# Altium schematic sheet S7CAS-PLEIADES-CARTE-MERE_Pxx_IO_SENSOR.SchDoc
size Tabloid; SheetNumber: 14; SheetTotal: 18; Sheet_Name: BTN, LED, TEMP SENSOR; Size: 11x17
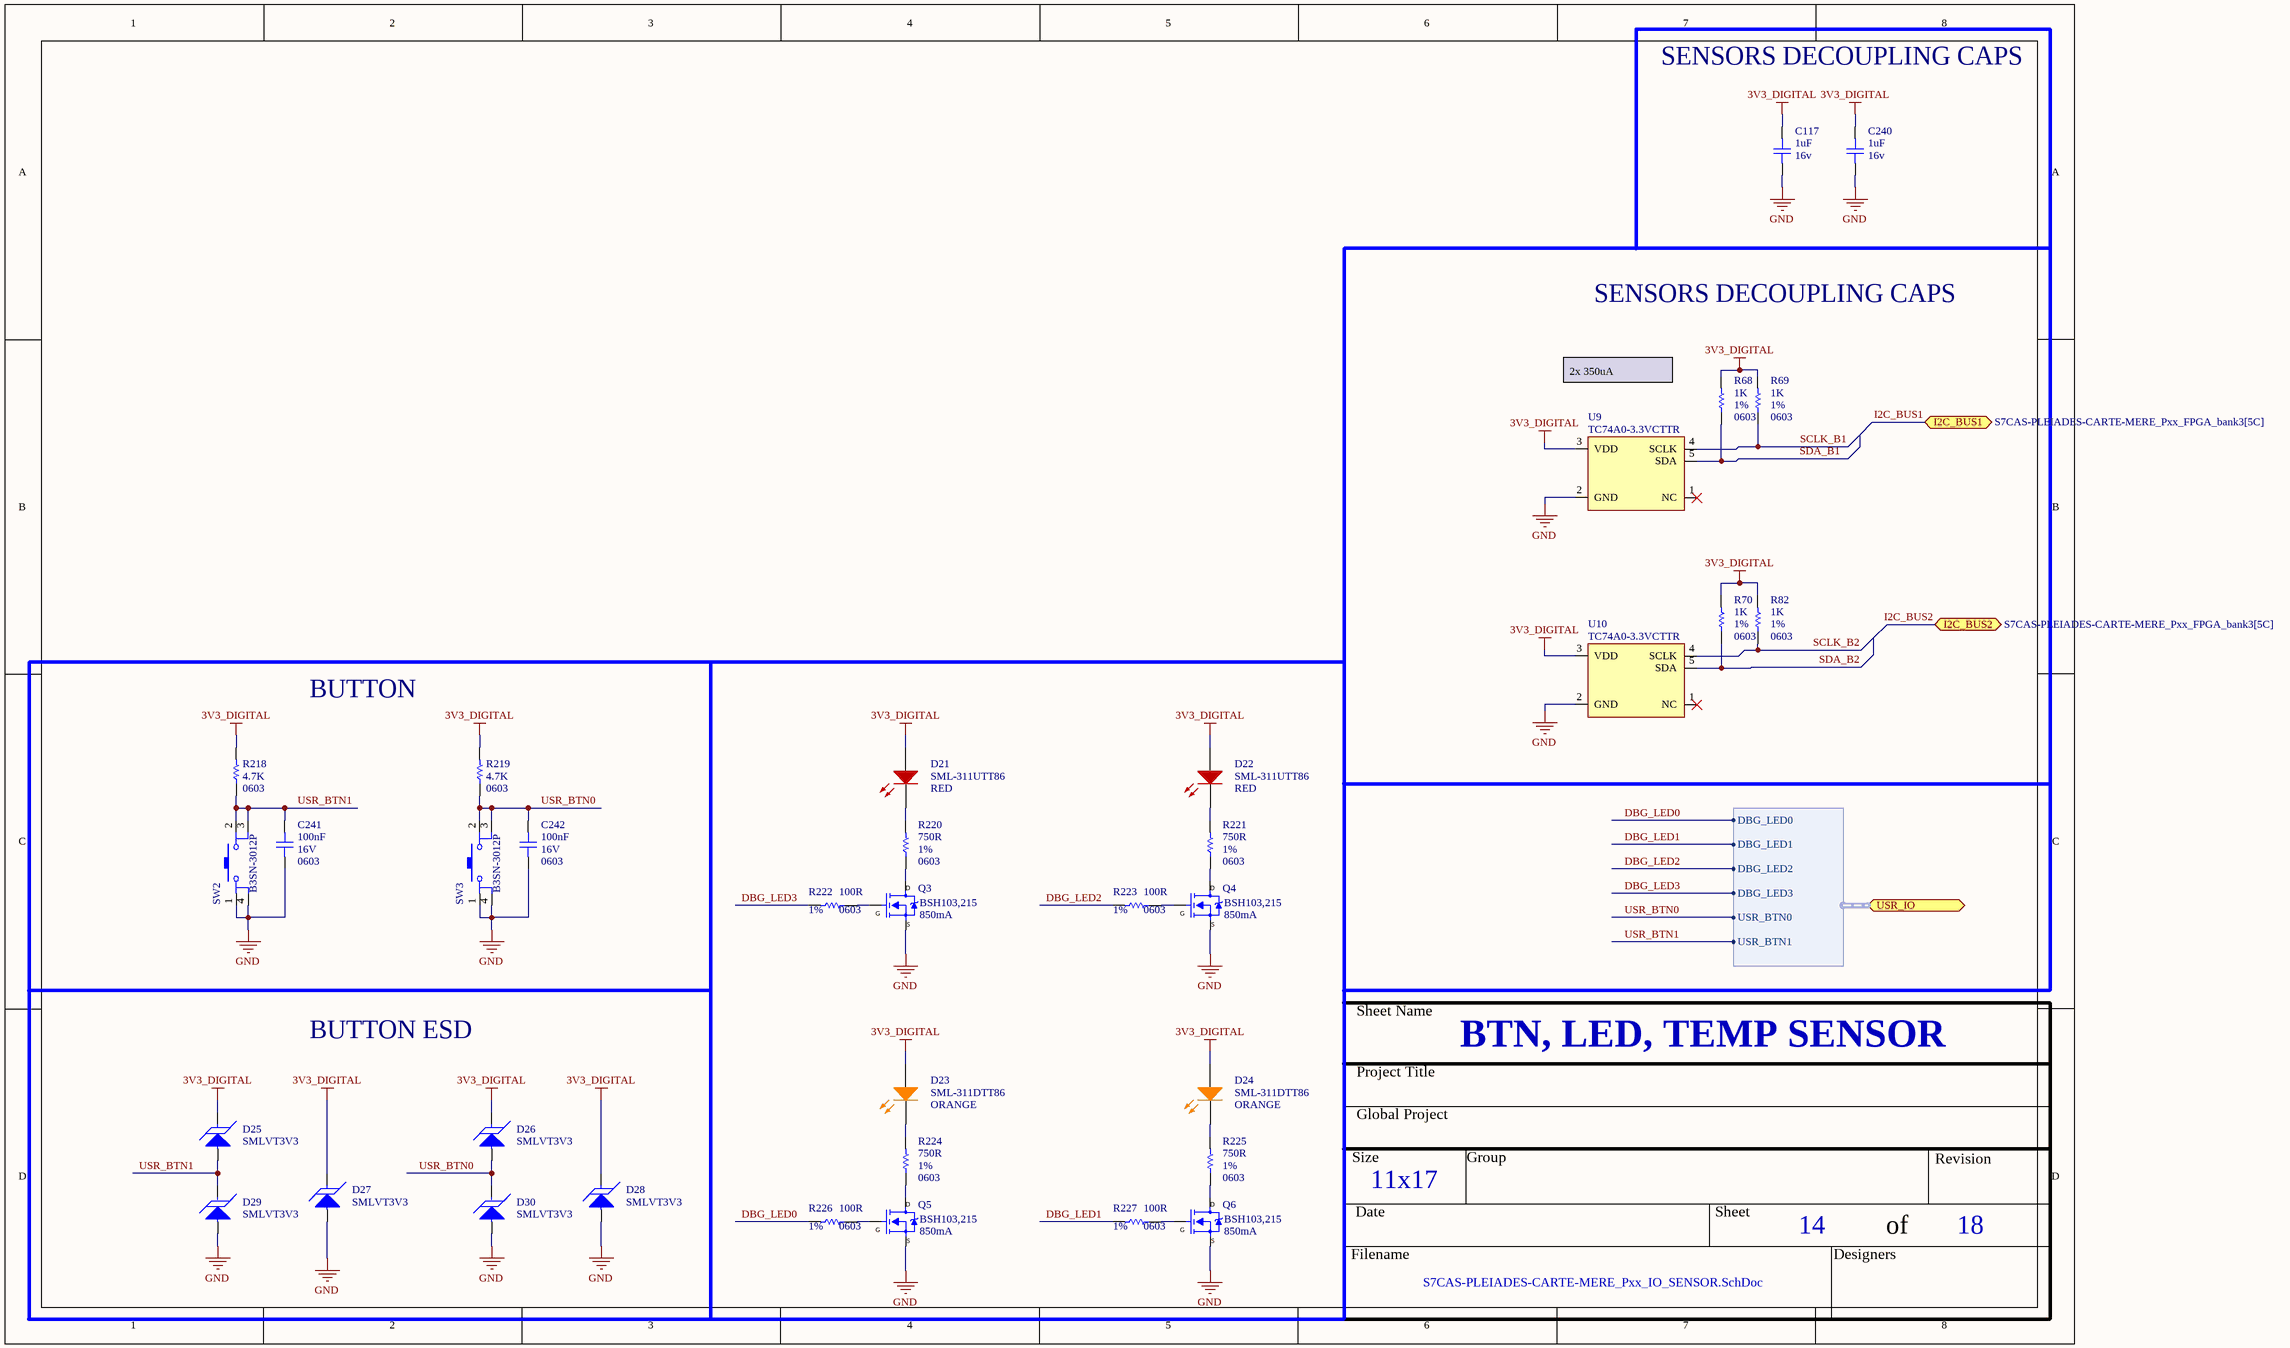
[diagram p0: S7CAS-PLEIADES-CARTE-MERE_Pxx_IO_SENSOR.SchDoc]

## Parts
C117  value 1uF  Voltage: 16v  [CAP_0603]  (hidden comment: CAP - 0603)
C240  value 1uF  Voltage: 16v  [CAP_0603]  (hidden comment: CAP - 0603)
C241  value 100nF  Voltage: 16V  Package: 0603  [CAP_0603]  (hidden comment: CAP - 0603)
C242  value 100nF  Voltage: 16V  Package: 0603  [CAP_0603]  (hidden comment: CAP - 0603)
D21  SML-311UTT86  value RED  [LED_0603]
D22  SML-311UTT86  value RED  [LED_0603]
D23  SML-311DTT86  value ORANGE  [LED_0603]
D24  SML-311DTT86  value ORANGE  [LED_0603]
D25  SMLVT3V3  [TVS_POW_SMLVT3V3]
D26  SMLVT3V3  [TVS_POW_SMLVT3V3]
D27  SMLVT3V3  [TVS_POW_SMLVT3V3]
D28  SMLVT3V3  [TVS_POW_SMLVT3V3]
D29  SMLVT3V3  [TVS_POW_SMLVT3V3]
D30  SMLVT3V3  [TVS_POW_SMLVT3V3]
Q3  BSH103,215  Current: 850mA  [SOT23-3]
Q4  BSH103,215  Current: 850mA  [SOT23-3]
Q5  BSH103,215  Current: 850mA  [SOT23-3]
Q6  BSH103,215  Current: 850mA  [SOT23-3]
R68  value 1K  Package: 0603  Precision: 1%  [RES_0603]  (hidden comment: RES - 0603)
R69  value 1K  Package: 0603  Precision: 1%  [RES_0603]  (hidden comment: RES - 0603)
R70  value 1K  Package: 0603  Precision: 1%  [RES_0603]  (hidden comment: RES - 0603)
R82  value 1K  Package: 0603  Precision: 1%  [RES_0603]  (hidden comment: RES - 0603)
R218  value 4.7K  Package: 0603  [RES_0603]  (hidden comment: RES - 0603)
R219  value 4.7K  Package: 0603  [RES_0603]  (hidden comment: RES - 0603)
R220  value 750R  Package: 0603  Precision: 1%  [RES_0603]  (hidden comment: RES - 0603)
R221  value 750R  Package: 0603  Precision: 1%  [RES_0603]  (hidden comment: RES - 0603)
R222  value 100R  Package: 0603  Precision: 1%  [RES_0603]  (hidden comment: RES - 0603)
R223  value 100R  Package: 0603  Precision: 1%  [RES_0603]  (hidden comment: RES - 0603)
R224  value 750R  Package: 0603  Precision: 1%  [RES_0603]  (hidden comment: RES - 0603)
R225  value 750R  Package: 0603  Precision: 1%  [RES_0603]  (hidden comment: RES - 0603)
R226  value 100R  Package: 0603  Precision: 1%  [RES_0603]  (hidden comment: RES - 0603)
R227  value 100R  Package: 0603  Precision: 1%  [RES_0603]  (hidden comment: RES - 0603)
SW2  B3SN-3012P  [SWI_TACT_B3SN-3012P]
SW3  B3SN-3012P  [SWI_TACT_B3SN-3012P]
U9  TC74A0-3.3VCTTR  [SEN_TEMP_TC74A0-3.3VCTTR]
U10  TC74A0-3.3VCTTR  [SEN_TEMP_TC74A0-3.3VCTTR]

## Blocks framed on the sheet
SENSORS DECOUPLING CAPS: C117 C240
SENSORS DECOUPLING CAPS: R68-R70 R82 U9 U10
BUTTON: C241 C242 R218 R219 SW2 SW3
BUTTON ESD: D25-D30

## Ports
I2C_BUS1 (bidir, see S7CAS-PLEIADES-CARTE-MERE_Pxx_FPGA_bank3[5C]), I2C_BUS2 (bidir, see S7CAS-PLEIADES-CARTE-MERE_Pxx_FPGA_bank3[5C]), USR_IO (bidir, harness USER_IOS_HARNESS, see S7CAS-PLEIADES-CARTE-MERE_Pxx_FPGA_bank3[5C])

## Harnesses
USER_IOS_HARNESS: DBG_LED0, DBG_LED1, DBG_LED2, DBG_LED3, USR_BTN0, USR_BTN1

## Nets
3V3_DIGITAL: C117.2 C240.2 D21.A D22.A D23.A D24.A D25.K D26.K D27.K D28.K R68.2 R69.2 R70.2 R82.2 R218.2 R219.2 U9.3(VDD) U10.3(VDD)
GND: C117.1 C240.1 C241.1 C242.1 D27.A D28.A D29.A D30.A Q3.2 Q4.2 Q5.2 Q6.2 SW2.1 SW2.4 SW3.1 SW3.4 U9.2(GND) U10.2(GND)
DBG_LED0: R226.2 ; port USR_IO.DBG_LED0
DBG_LED1: R227.2 ; port USR_IO.DBG_LED1
DBG_LED2: R223.2 ; port USR_IO.DBG_LED2
DBG_LED3: R222.2 ; port USR_IO.DBG_LED3
SCLK_B1: R69.1 U9.4(SCLK)
SCLK_B2: R82.1 U10.4(SCLK)
SDA_B1: R68.1 U9.5(SDA)
SDA_B2: R70.1 U10.5(SDA)
USR_BTN0: C242.2 D26.A D30.K R219.1 SW3.2 SW3.3 ; port USR_IO.USR_BTN0
USR_BTN1: C241.2 D25.A D29.K R218.1 SW2.2 SW2.3 ; port USR_IO.USR_BTN1
NetD21_K: D21.K R220.2
NetD22_K: D22.K R221.2
NetD23_K: D23.K R224.2
NetD24_K: D24.K R225.2
NetQ3_1: Q3.1 R222.1
NetQ3_3: Q3.3 R220.1
NetQ4_1: Q4.1 R223.1
NetQ4_3: Q4.3 R221.1
NetQ5_1: Q5.1 R226.1
NetQ5_3: Q5.3 R224.1
NetQ6_1: Q6.1 R227.1
NetQ6_3: Q6.3 R225.1

Not connected (* = marked no-connect by the designer): U9 1(NC)*; U10 1(NC)*

## Buses and harness runs
bus I2C_BUS1 = port I2C_BUS1
bus I2C_BUS2 = port I2C_BUS2

## Notes on the sheet
- 2x 350uA
- Sheet Name
- Project Title
- Global Project
- Size
- Group
- Revision
- Date
- Sheet
- of
- Filename
- Designers
- (in symbol MOS_N_CHANNEL) D; G; S

## Library data of the parts
C117 C240-C242 = CAP - 0603: Precision: 10%; Current: *; CreatedBy: Jonathan Bouchard; Power: *; Supplier 1: Arrow Electronics
  C117 C240: Package: 0603; Supplier Part Number 1: CL10B105MO8NNWC
  C241 C242: Supplier Part Number 1: CL10B104KO8NNNC
D21 D22 = LED_SML-311UTT86: LED - 620nM RED 2mA - 0603; Voltage: 1.8V; Mfg: ROHM Semiconductor; Power: 44mW; Current: 2mA; HelpURL: http://media.digikey.com/pdf/Data%20Sheets/Rohm%20PDFs/SML-311%20Series.pdf; CreatedBy: Jonathan Bouchard; Temperature: -30°C to 85°C; Package: 0603; Precision: *; Mfg Part Number: SML-311UTT86; Supplier 1: Digikey; Supplier Part Number 1: 511-1304-1-ND
D23 D24 = LED_SML-311DTT86: LED - 611nM ORANGE 2mA - 0603; Voltage: 1.8V; Mfg: ROHM Semiconductor; Power: 44mW; Current: 2mA; HelpURL: http://media.digikey.com/pdf/Data%20Sheets/Rohm%20PDFs/SML-311%20Series.pdf; CreatedBy: Jonathan Bouchard; Temperature: -40°C to 85°C; Package: 0603; Precision: *; Mfg Part Number: SML-311DTT86; Supplier 1: Digikey; Supplier Part Number 1: 511-1303-1-ND
D25-D30 = TVS_POW_SMLVT3V3: TVS - 3.3V 10.3V 600W - DO214AA; Manufacturer #1: STMicroelectronics; Value: Vbr = 4.1V -  Clamp = 10.3V; Voltage Rating: 3.3V Standoff; Current Rating: 200A (Ifsm); Power Max: 600W (Ppp); GRAMS Lib Spec: 2.8; Magnetic Material: UNKNOWN; Polarized: YES; Tolerance: *; HelpURL: https://www.st.com/content/ccc/resource/technical/document/datasheet/da/a4/86/90/17/13/47/7c/CD00000923.pdf/files/CD00000923.pdf/jcr:content/translations/en.CD00000923.pdf; CreatedBy/Date: Jonathan Bouchard - 2019-04-27; VerifiedBy: Nicolas V. (2019-05-06); Temperature: -55°C ~ 175°C (TJ); Package: DO214AA; Manufacturer #2: *; Note: *; Assembly Type: SMD; Part Number #2: *; Part Number #1: SMLVT3V3; Supplier 1: Digi-Key; Supplier Part Number 1: 497-2496-1-ND; Cryo: UNKNOWN
Q3-Q6 = MOS_N_CHANNEL: N-Channel  Enhancement Mode Field Effect Transistor; Mfr: *; Package / Case: *; Vds: *; Rds ON: *; Vgs: *; Operating Temperature: *; Supplier 1: Avnet; Supplier Part Number 1: BSH103,215
R218 R219 = RES - 0603: Precision: 1%; Current: *; CreatedBy: Jonathan Bouchard; Supplier 1: Arrow Electronics; Supplier Part Number 1: RMCF0603FT4K70
SW2 SW3 = SWI_TACT_B3SN-3012P: SWI - TACT SPST-NO 0.05A 24V - 4-SMD; Current: 50mA; Mfg: Omron; Mfg Part Number: B3SN-3012P; HelpURL: http://www.omron.com/ecb/products/pdf/en-b3sn.pdf; CreatedBy: Jonathan Bouchard; Temperature: -25°C ~ 70°C; Power: *; Precision: *; Package: 4-SMD; Value: *; Voltage: 24V; Supplier 1: Digikey; Supplier Part Number 1: SW261CT-ND
U9 U10 = SENS_TEMP_TC74A0-3.3VCTTR: SENS - TEMPERATURE SENSOR I2C/SMBUS - SOT23-5; Voltage: 2.7 V ~ 5.5 V; Mfg: Microchip; Precision: ±2°C (±3°C); Current: *; Power: *; Mfg Part Number: TC74A0-3.3VCTTR; HelpURL: http://ww1.microchip.com/downloads/en/DeviceDoc/21462D.pdf; CreatedBy: Jonathan Bouchard; Temperature: -40°C ~ 125°C; Value: *; Package: SOT23-5; Supplier 1: Digikey; Supplier Part Number 1: TC74A0-3.3VCTDKR-ND
R68-R70 R82 R220-R227 = RES - 0603: Current: *; CreatedBy: Jonathan Bouchard
  R220 R221 R224 R225: Supplier 1: Arrow Electronics; Supplier Part Number 1: RMCF0603FT750R
  R222 R223 R226 R227: Supplier 1: Arrow Electronics; Supplier Part Number 1: RMCF0603FT100R